# EAGLE schematic NEW 電源基板 (EAGLE 9.6.2)

## Sheet 1 of 2
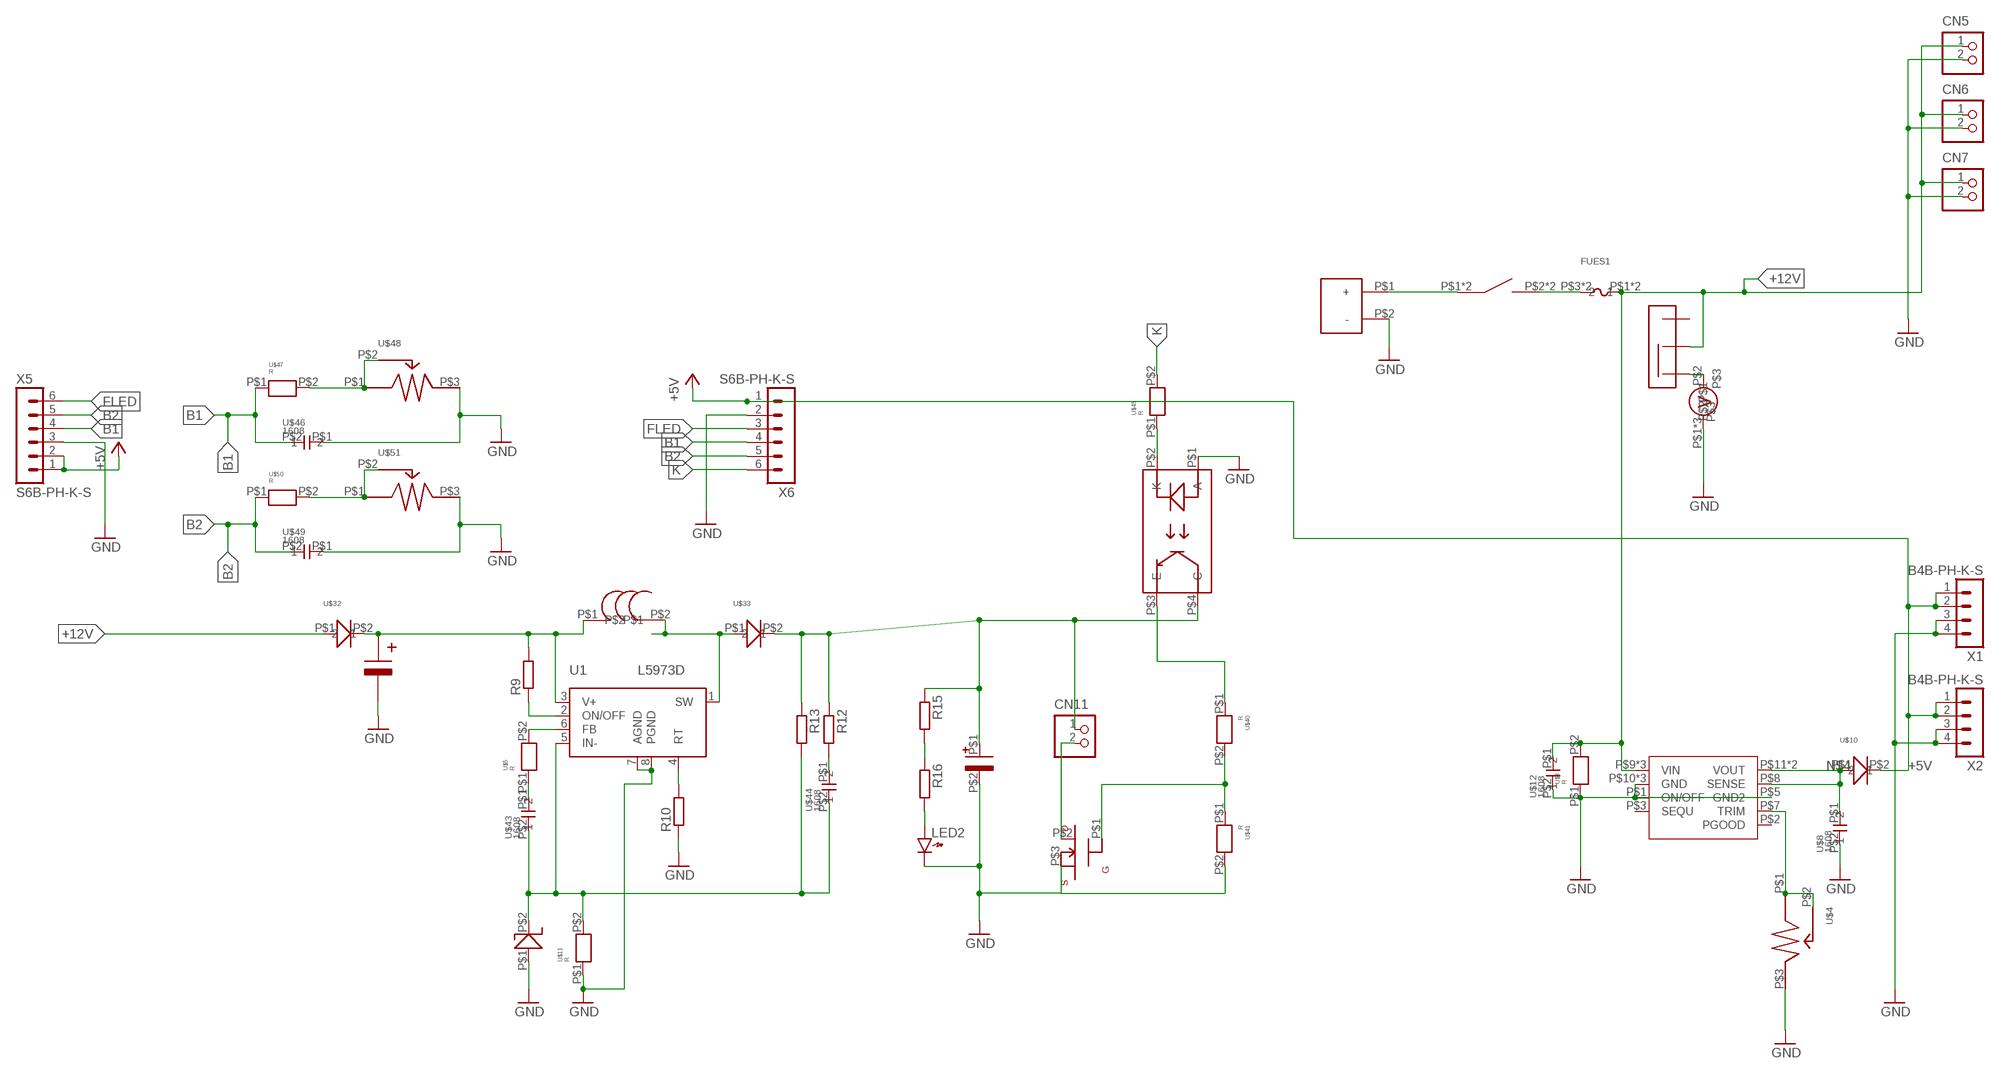
[diagram p0: schematic, sheet 1]

### Parts
CN5  S2B-XH-A  [S2B-XH-A]
CN6  S2B-XH-A  [S2B-XH-A]
CN7  S2B-XH-A  [S2B-XH-A]
CN11  B2B-XH-A  [B2B-XH-A]
FUES1  FUSE  [FUSE]
LED2  LED1608  [LED1608]
R9  R-EU_0207/10  [0207/10]
R10  R-EU_0207/10  [0207/10]
R12  R-EU_0207/10  [0207/10]
R13  R-EU_0207/10  [0207/10]
R15  R-EU_0207/10  [0207/10]
R16  R-EU_0207/10  [0207/10]
U1  L5973D  [HSOP8]
U$1  SW3  [SW3]
U$2  DCDC  [DC-DC]
U$3  R  [1608]
U$4  VR  [VR]
U$5  R  [1608]
U$6  V  [V]
U$7  XT60  [XT60]
U$8  1608  [CON]
U$9  SSW  [SSW]
U$10  D  [D]
U$11  R  [1608]
U$12  1608  [CON]
U$13  I  [I]
U$32  D  [D]
U$33  D  [D]
U$36  MOS  [MOS]
U$37  PHOTOCOUPLER  [PHOTOCOUPLER]
U$38  TD  [TD]
U$39  FGFG2  [FG2]
U$40  R  [1608]
U$41  R  [1608]
U$42  10  [10]
U$43  1608  [CON]
U$44  1608  [CON]
U$45  R  [1608]
U$46  1608  [CON]
U$47  R  [1608]
U$48  VR  [VR]
U$49  1608  [CON]
U$50  R  [1608]
U$51  VR  [VR]
X1  B4B-PH-K-S  [B4B-PH-K-S]
X2  B4B-PH-K-S  [B4B-PH-K-S]
X5  S6B-PH-K-S  [S6B-PH-K-S]
X6  S6B-PH-K-S  [S6B-PH-K-S]

### Nets
+5V: U$10.P$2 X1.1 X1.2 X2.1 X2.2 X5.1 X5.2 X6.1
+12V: CN5.1 CN6.1 CN7.1 FUES1.P$1 FUES1.P$2 U$2.P$9(VIN) U$2.P$14(VIN) U$2.P$15(VIN) U$3.P$2 U$9.P$3 U$12.P$1 U$32.P$1
B1: U$46.P$2 U$47.P$1 X5.4 X6.4
B2: U$49.P$2 U$50.P$1 X5.5 X6.5
FLED: X5.6 X6.3
GND: CN5.2 CN6.2 CN7.2 LED2.K R10.1 U$2.P$1(ON/OFF) U$2.P$5(GND2) U$2.P$10(GND) U$2.P$16(GND) U$2.P$17(GND) U$3.P$1 U$4.P$3 U$6.P$1 U$6.P$4 U$6.P$5 U$7.P$2(-) U$8.P$2 U$12.P$2 U$36.P$3 U$37.P$1(A) U$38.P$1 U$39.P$2 U$41.P$2 U$42.P$2 U$46.P$1 U$48.P$3 U$49.P$1 U$51.P$3 X1.3 X1.4 X2.3 X2.4 X5.3 X6.2
K: U$45.P$2 X6.6
N$2: U$6.P$2 U$9.P$1
N$3: U$2.P$7(TRIM) U$4.P$1 U$4.P$2
N$4: U$2.P$8(SENSE) U$2.P$11(VOUT) U$2.P$18(VOUT) U$8.P$1 U$10.P$1
N$6: FUES1.P$3 FUES1.P$4 U$1.P$2 U$1.P$4
N$7: U$1.P$1 U$1.P$3 U$7.P$1(+)
N$27: CN11.1 R12.1 R13.1 R15.1 U$33.P$2 U$37.P$4(C) U$39.P$1
N$28: U$37.P$3(E) U$40.P$1
N$29: CN11.2 U$36.P$2
N$30: U$36.P$1 U$40.P$2 U$41.P$1
N$32: R9.2 U1.3(V+) U$13.P$1 U$32.P$2 U$42.P$1
N$33: R9.1 U1.2(ON/OFF)
N$34: R10.2 U1.4(RT)
N$35: R13.2 U1.5(IN-) U$11.P$2 U$38.P$2 U$43.P$2 U$44.P$2
N$36: R12.2 U$44.P$1
N$38: U1.6(FB) U$5.P$2
N$39: U$5.P$1 U$43.P$1
N$40: U$37.P$2(K) U$45.P$1
N$41: U$47.P$2 U$48.P$1 U$48.P$2
N$42: U$50.P$2 U$51.P$1 U$51.P$2
N$43: R15.2 R16.1
N$44: LED2.A R16.2
PGND: U1.7(AGND) U1.8(PGND) U$11.P$1 ; supply symbol labelled GND
SW: U1.1(SW) U$13.P$2 U$33.P$1
Unconnected: U$2.P$2(PGOOD) U$2.P$3(SEQU) U$6.P$3 U$9.P$2

## Sheet 2 of 2

## Power pins joined to a net without a drawn wire
GND: U1.9(GND)

## Library data of the parts
CN5-CN7 = jst-xh:S2B-XH-A: Wire-to-Board 2.5mm pitch side mount connector Source: http://www.jst-mfg.com/product/pdf/jpn/XH.pdf http://www.jst-mfg.com/product/detail.php?series=277
CN11 = jst-xh:B2B-XH-A: Wire-to-Board 2.5mm pitch top mount connector Source: http://www.jst-mfg.com/product/pdf/jpn/XH.pdf http://www.jst-mfg.com/product/detail.php?series=277
FUES1 = fuse:FUSE
LED2 = generic:LED: Generic LEDs
R9 R10 R12 R13 R15 R16 = rcl:R-EU_: RESISTOR, European symbol; SPICEPREFIX: R
U1 = l5973d:L5973D: 2.5A switch step down switching regulator
U$1 = SW3:SW3
U$2 = OKL:DCDC
U$3 U$5 U$11 U$40 U$41 U$45 U$47 U$50 = R 1608:R
U$4 U$48 U$51 = VR tippu:VR
U$6 = voltmeter:V
U$7 = XT60:XT60
U$8 U$12 U$43 U$44 U$46 U$49 = con1608:1608
U$9 = SSW:SSW
U$10 U$32 U$33 = D 40V2A:D
U$13 = Inductor_Read:I
U$36 = MOS-FET:MOS
U$37 = Photo coupler:PHOTOCOUPLER
U$38 = ZD 3.9V200mW:TD
U$39 = C FG:FG
U$42 = 10uF50V 電解:10
X1 X2 = con-JST PH:B4B-PH: JST PH series header 2.00mm pitch disconnectable crimp style connectors, vertical (side entry type), 4 pins
X5 X6 = con-JST PH:S6B-PH: JST PH series header 2.00mm pitch disconnectable crimp style connectors, horizontal (side entry type), 6 pins

## Net classes
0 default: width 0.762 mm, clearance 0.254 mm